# EAGLE schematic solar_EVSE (EAGLE 7.5.0)
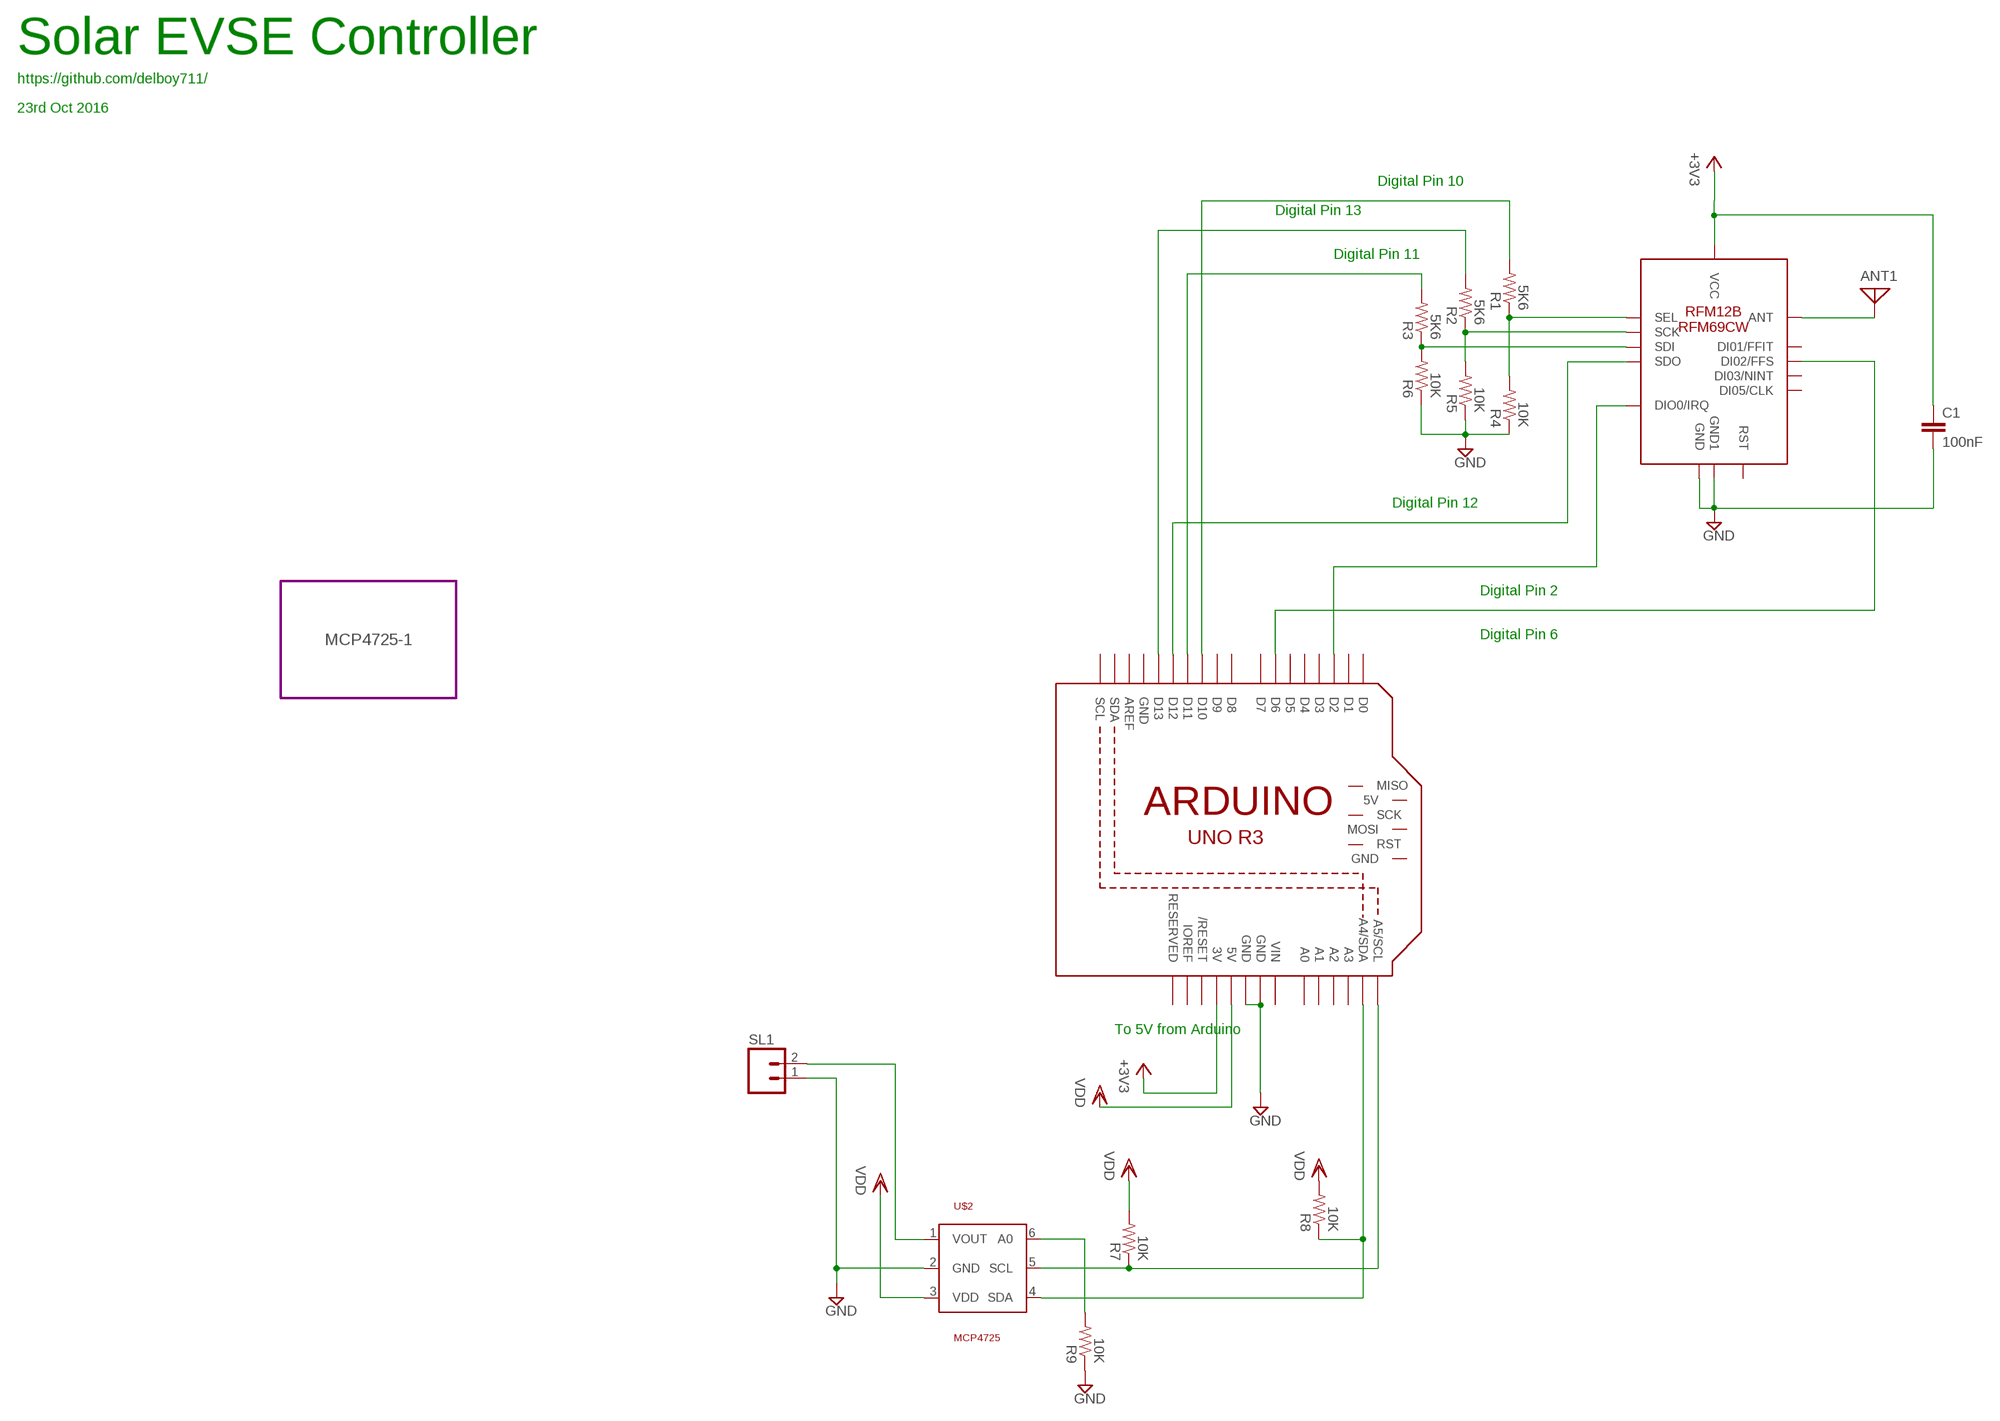
[diagram p0: schematic, sheet 1]

## Parts
ANT1  ANTENNA  [PAD-01]
C1  100nF  C-EU025-040X050  [C025-040X050]
M1  ARDUINO_R3_ICSP  [ARDUINOR3_ICSP]
R1  5K6  R-US_0204/7  [0204/7]
R2  5K6  R-US_0204/7  [0204/7]
R3  5K6  R-US_0204/7  [0204/7]
R4  10K  R-US_0204/7  [0204/7]
R5  10K  R-US_0204/7  [0204/7]
R6  10K  R-US_0204/7  [0204/7]
R7  10K  R-US_0204/7  [0204/7]
R8  10K  R-US_0204/7  [0204/7]
R9  10K  R-US_0204/7  [0204/7]
SL1  M02  [02P]
U$1  RFM12B/69CW  [RFM12B/69CW]
U$2  MCP4725  [SOT23-6]

## Module instances
MCP4725-1 = MCP4725

## Nets
+3V3: C1.1 M1.3V U$1.VDD(VCC)
GND: C1.2 M1.GND@1(GND) M1.GND@3(GND) R4.1 R5.1 R6.1 R9.1 SL1.1 U$1.GND U$1.GND1 U$2.2(GND)
N$1: M1.A5(A5/SCL) R7.1 U$2.5(SCL)
N$2: M1.D6 U$1.FFS(DI02/FFS)
N$3: M1.A4(A4/SDA) R8.1 U$2.4(SDA)
N$5: R9.2 U$2.6(A0)
N$6: ANT1.1 U$1.ANT
N$7: R1.1 R4.2 U$1.SEL
N$8: R2.1 R5.2 U$1.SCK
N$9: SL1.2 U$2.1(VOUT)
N$12: R3.1 R6.2 U$1.SDI
N$24: M1.D12 U$1.SDO
N$25: M1.D10 R1.2
N$27: M1.D13 R2.2
N$28: M1.D11 R3.2
N$29: M1.D2 U$1.IRQ(DIO0/IRQ)
VDD: M1.5V R7.2 R8.2 U$2.3(VDD)
Unconnected: M1.5V_ICSP(5V) M1.A0 M1.A1 M1.A2 M1.A3 M1.AREF M1.D0 M1.D1 M1.D3 M1.D4 M1.D5 M1.D7 M1.D8 M1.D9 M1.GND@2(GND) M1.IOREF M1.MISO M1.MOSI M1.RESERVED M1.RESET(/RESET) M1.RESET_ICSP(RST) M1.SCK M1.SCL M1.SDA U$1.CLK(DI05/CLK) U$1.FFIT(DI01/FFIT) U$1.NINT(DI03/NINT) U$1.RST

## Notes on the sheet
- Solar EVSE Controller
- https://github.com/delboy711/
- 23rd Oct 2016
- Digital Pin 10
- Digital Pin 13
- Digital Pin 11
- Digital Pin 12
- Digital Pin 2
- Digital Pin 6
- To 5V from Arduino

## Power pins joined to a net without a drawn wire
GND: M1.GND
VIN: M1.VIN

## Library data of the parts
ANT1 = discrete:ANTENNA: Antenna
C1 = resistor:C-EU: CAPACITOR, European symbol
M1 = adafruit:ARDUINO_R3_ICSP
R1-R9 = resistor:R-US_: RESISTOR, American symbol
SL1 = con-amp-quick:M02: AMP QUICK CONNECTOR; OC_FARNELL: unknown; OC_NEWARK: unknown
U$1 = Eagle-JeeLabs:RFM12B/69CW
U$2 = Eagle-JeeLabs:MCP4725

## Module MCP4725
Ports: 

### Library data of the parts